# EAGLE design Strvo_Tester_STM_renual_v1 (EAGLE 6.5.0)
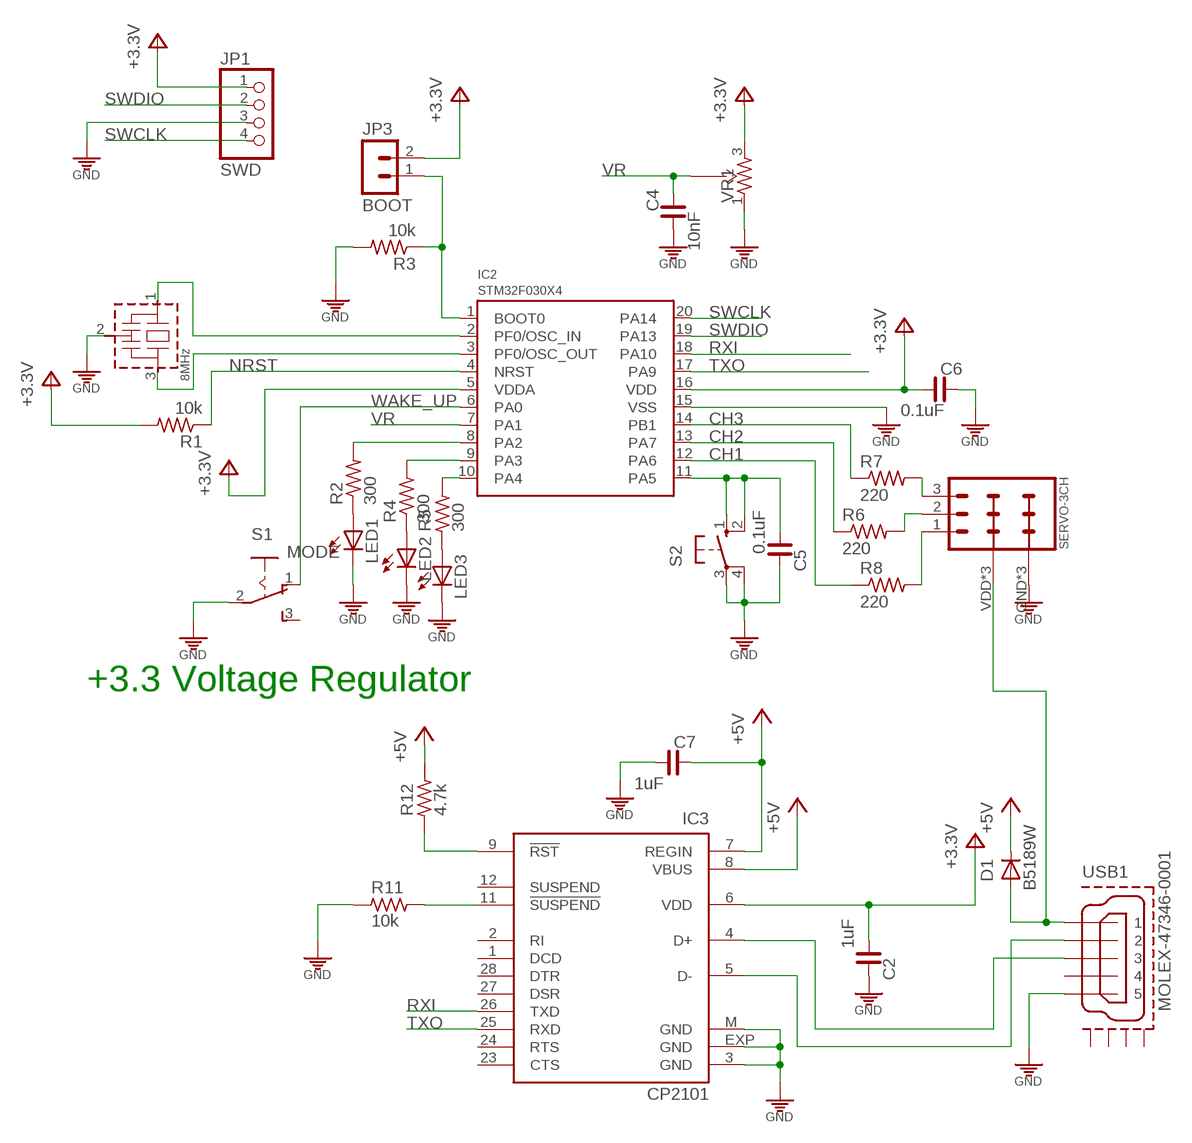
[diagram p0: schematic, sheet 1]

## Parts
C2  1uF  C_0603  [C0603]
C4  10nF  C_0603  [C0603]
C5  0.1uF  C_0603  [C0603]
C6  0.1uF  C_0603  [C0603]
C7  1uF  C_0603  [C0603]
D1  B5189W  B5189WN  [SOD323]
IC2  STM32F030X4  [TSSOP20]
IC3  CP2101  [MLP28]
JP1  SWD  PINHD-1X4M  [1X04M]
JP2  SERVO-3CH  [SERVO-3CH1]
JP3  BOOT  MA021.25  [MA02-MINI]
LED1  LED3MM  [LED3MM]
LED2  LED3MM  [LED3MM]
LED3  LED3MM  [LED3MM]
Q1  8MHz  X-TAL-SMALLCSTCE16M00V53  [CSTLA_X]
R1  10k  R-US_R1608  [R0603]
R2  300  R-US_R1608  [R0603]
R3  10k  R-US_R1608  [R0603]
R4  300  R-US_R1608  [R0603]
R5  300  R_0603  [R0603]
R6  220  R-US_R1608  [R0603]
R7  220  R-US_R1608  [R0603]
R8  220  R-US_R1608  [R0603]
R11  10k  R_0603  [R0603]
R12  4.7k  R_0603  [R0603]
S1  MODE  IMMS  [255SB]
S2  10-XX  [B3F-10XX]
USB1  MOLEX-47346-0001  [MOLEX-47364-0001]
VR1  R-TRIMMER-SMDPTV  [PTV09]

## Nets
3V3: C2.2 C6.2 IC2.5(VDDA) IC2.16(VDD) IC3.6(VDD) JP1.1 JP3.2 R1.2 VR1.3 ; supply symbol labelled +3V3
+5V: C7.1 D1.C IC3.7(REGIN) IC3.8(VBUS) R12.2
CH1: IC2.12(PA6) R8.1
CH2: IC2.13(PA7) R6.1
CH3: IC2.14(PB1) R7.1
GND: C2.1 C4.2 C5.1 C6.1 C7.2 IC2.15(VSS) IC3.3(GND) IC3.EXP(GND) IC3.M(GND) JP1.3 JP2.GND JP2.GND@1(GND) JP2.GND@2(GND) LED1.K(C) LED2.K(C) LED3.K(C) Q1.2(GND) R3.2 R11.1 S1.2(P) S2.3(P) S2.4(P1) USB1.5 VR1.1
N$1: LED1.A R2.1
N$2: IC2.2(PF0/OSC_IN) Q1.1(IN)
N$3: IC2.3(PF0/OSC_OUT) Q1.3(OUT)
N$4: JP2.3 R7.2
N$5: IC2.8(PA2) R2.2
N$6: IC2.1(BOOT0) JP3.1 R3.1
N$7: C5.2 IC2.11(PA5) S2.1(S) S2.2(S1)
N$8: IC3.5(D-) USB1.2
N$9: JP2.2 R6.2
N$10: IC2.10(PA4) R5.2
N$11: LED2.A R4.1
N$12: JP2.1 R8.2
N$13: IC2.9(PA3) R4.2
N$17: LED3.A R5.1
N$20: IC3.4(D+) USB1.3
N$22: D1.A JP2.VDD(+5V) JP2.VDD@1(+5V) JP2.VDD@2(+5V) USB1.1
N$23: IC3.11(!SUSPEND) R11.2
N$24: IC3.9(!RST) R12.1
NRST: IC2.4(NRST) R1.1
RXI: IC2.18(PA10) IC3.26(TXD)
SWCLK: IC2.20(PA14) JP1.4
SWDIO: IC2.19(PA13) JP1.2
TXO: IC2.17(PA9) IC3.25(RXD)
VR: C4.1 IC2.7(PA1) VR1.2
WAKE_UP: IC2.6(PA0) S1.1(O)
Unconnected: IC3.1(DCD) IC3.2(RI) IC3.12(SUSPEND) IC3.23(CTS) IC3.24(RTS) IC3.27(DSR) IC3.28(DTR) S1.3(S) USB1.4 USB1.GND1 USB1.GND2 USB1.GND3 USB1.GND4

## Notes on the sheet
- +3.3 Voltage Regulator

## Library data of the parts
C2 C4-C7 = cona_lib:C_: NON-POLARIZED CAP
D1 = cona_lib:B5189W
IC2 = stm32:STM32F030X4
IC3 = silabs:CP210*: Single-Chip USB to UART Bridge Source: www.silabs.com .. CP2101.pdf / cp2102.pdf; MF: FARNELL; MPN: CP2102-GM; OC_FARNELL: 9282130; OC_NEWARK: 30K5635
JP1 = pinhead:PINHD-1X4: PIN HEADER
JP2 = cona_lib:SERVO-3CH
JP3 = cona_lib:MA02
LED1-LED3 = cona_lib:LED: LED OSRAM: - CHIPLED LG R971, LG N971, LY N971, LG Q971, LY Q971, LO R971, LY R971 LH N974, LH R974 LS Q976, LO Q976, LY Q976 LO Q996 - Hyper CHIPLED LW Q18S LB Q993, LB Q99A, LB R99A - SideLED LS A670, LO A670, LY A670, LG A670, LP A670 LB A673, LV A673, LT A673, LW A673 LH A674 LY A675 LS A676, LA A676, LO A676, LY A676, LW A676 LS A679, LY A679, LG A679 - Hyper Micro SIDELED® LS Y876, LA Y876, LO Y876, LY Y876 LT Y87S - SmartLED LW L88C, LW L88S LB L89C, LB L89S, LG L890 LS L89K, LO L89K, LY L89K LS L896, LA L896, LO L896, LY L896 - TOPLED LS T670, LO T670, LY T670, LG T670, LP T670 LSG T670, LSP T670, LSY T670, LOP T670, LYG T670 LG T671, LOG T671, LSG T671 LB T673, LV T673, LT T673, LW T673 LH T674 LS T676, LA T676, LO T676, LY T676, LB T676, LH T676, LSB T676, LW T676 LB T67C, LV T67C, LT T67C, LS T67K, LO T67K, LY T67K, LW E67C LS E67B, LA E67B, LO E67B, LY E67B, LB E67C, LV E67C, LT E67C LW T67C LS T679, LY T679, LG T679 LS T770, LO T770, LY T770, LG T770, LP T770 LB T773, LV T773, LT T773, LW T773 LH T774 LS E675, LA E675, LY E675, LS T675 LS T776, LA T776, LO T776, LY T776, LB T776 LHGB T686 LT T68C, LB T68C - Hyper Mini TOPLED® LB M676 - Mini TOPLED Santana® LG M470 LS M47K, LO M47K, LY M47K Source: http://www.osram.convergy.de LUXEON: - LUMILED® LXK2-PW12-R00, LXK2-PW12-S00, LXK2-PW14-U00, LXK2-PW14-V00 LXK2-PM12-R00, LXK2-PM12-S00, LXK2-PM14-U00 LXK2-PE12-Q00, LXK2-PE12-R00, LXK2-PE12-S00, LXK2-PE14-T00, LXK2-PE14-U00 LXK2-PB12-K00, LXK2-PB12-L00, LXK2-PB12-M00, LXK2-PB14-N00, LXK2-PB14-P00, LXK2-PB14-Q00 LXK2-PR12-L00, LXK2-PR12-M00, LXK2-PR14-Q00, LXK2-PR14-R00 LXK2-PD12-Q00, LXK2-PD12-R00, LXK2-PD12-S00 LXK2-PH12-R00, LXK2-PH12-S00 LXK2-PL12-P00, LXK2-PL12-Q00, LXK2-PL12-R00 Source: www.luxeon.com KINGBRIGHT: KA-3528ASYC Source: www.kingbright.com
Q1 = cona_lib:X-TAL-SMALL: Ceramic Resonators MuRata CSTCE08MOOG52A
R1-R4 R6-R8 = cona_lib:R-US_: RESISTOR, American symbol
R5 R11 R12 = cona_lib:R_: RESISTOR
S1 = cona_lib:IMMS: SLIDING SWITCH Distributor Buerklin, 11G810
S2 = switch-omron:10-XX: OMRON SWITCH; MPN: B3F-1000; OC_FARNELL: 176432; OC_NEWARK: 36M3542
USB1 = usb_con-update:MOLEX-47346-0001: MICRO USB B, BOTTOM MOUNT
VR1 = cona_lib:R-TRIMMER-SMD: SMD R-TRIMMER

## Net classes
0 default: clearance 0.152 mm
2 GND: width 0.2 mm, clearance 0.152 mm

## Board
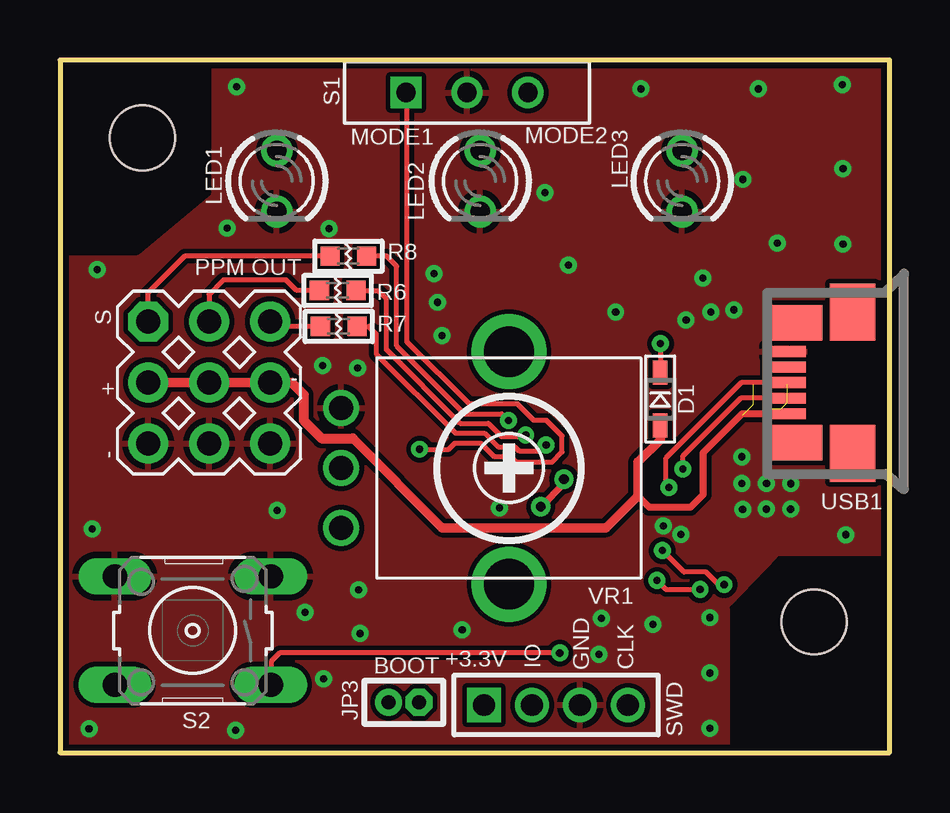
[diagram p1: board, top side]
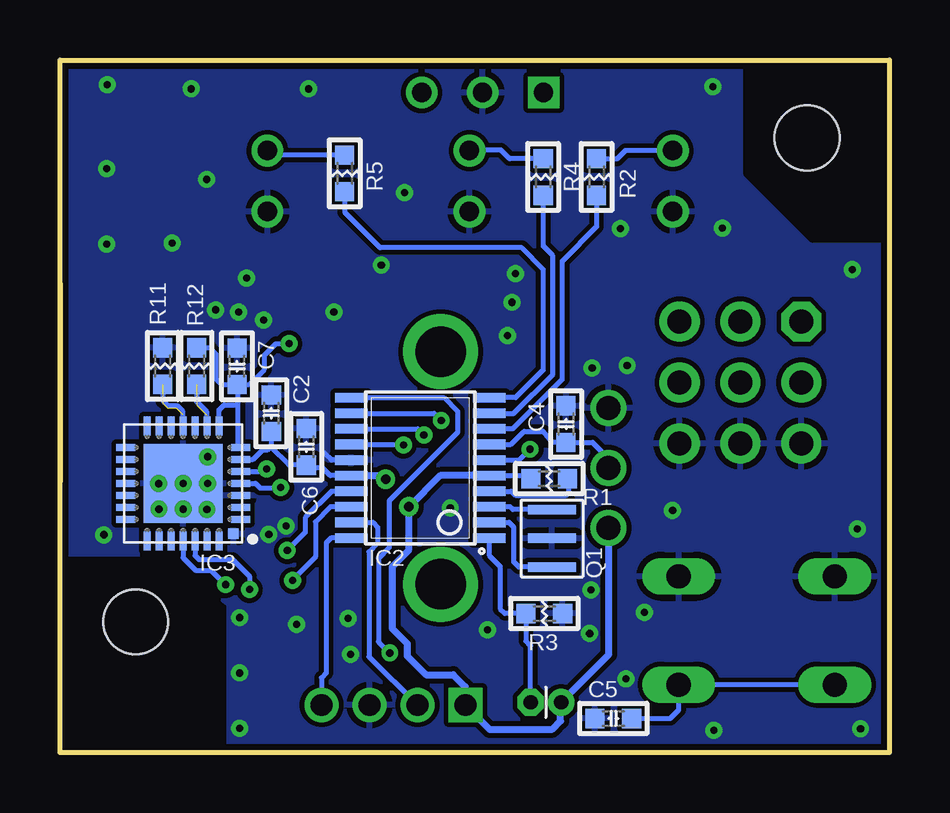
[diagram p2: board, bottom side, seen from below]

Size 34.58 x 28.88 mm. Coordinates in mm from the lower left corner, seen from the top.
Outline: 34.58,0 34.58,28.88 0,28.88 0,0 34.58,0
Copper layers (1+16): Top 0.035mm / dielectric 1.5mm / Bottom 0.035mm
Design rules "default": minimum track width 0.2mm, minimum drill 0.3mm, track to track 0.2mm, track to pad 0.2mm, pad to pad 0.2mm, via to via 0.2mm, smd to smd 0.2mm, copper to edge 10mil, drill to drill 0.2mm, minimum pad ring 10mil, minimum via ring 8mil, stop-mask expansion 4mil, vias tented up to drill 0mil, thermal gap 10mil
Holes 2.7 mm at 31.43,5.45 3.43,25.63

### Footprints (pad centres in the part's own frame; a part is rotated, then mirrored left to right if it is on the bottom)
C0603 = smd 0.8 x 0.8: 1 -0.762,0; 2 0.762,0
SOD323 = smd 1 x 0.6: A 1.1,0; C -1.1,0
TSSOP20 = smd 0.4 x 1.35: 1 -2.925,-2.875; 2 -2.275,-2.875; 3 -1.625,-2.875; 4 -0.975,-2.875; 5 -0.325,-2.875; 6 0.325,-2.875; 7 0.975,-2.875; 8 1.625,-2.875; 9 2.275,-2.875; 10 2.925,-2.875; 11 2.925,2.875; 12 2.275,2.875; 13 1.625,2.875; 14 0.975,2.875; 15 0.325,2.875; 16 -0.325,2.875; 17 -0.975,2.875; 18 -1.625,2.875; 19 -2.275,2.875; 20 -2.925,2.875
MLP28 = smd 0.8 x 0.3: 1 -2.4,1.5; 2 -2.4,1; 3 -2.4,0.5; 4 -2.4,0; 5 -2.4,-0.5; 6 -2.4,-1; 7 -2.4,-1.5; 15 2.4,-1.5; 16 2.4,-1; 17 2.4,-0.5; 18 2.4,0; 19 2.4,0.5; 20 2.4,1; 21 2.4,1.5 | smd 0.3 x 0.8: 8 -1.5,-2.4; 9 -1,-2.4; 10 -0.5,-2.4; 11 0,-2.4; 12 0.5,-2.4; 13 1,-2.4; 14 1.5,-2.4; 22 1.5,2.4; 23 1,2.4; 24 0.5,2.4; 25 0,2.4; 26 -0.5,2.4; 27 -1,2.4; 28 -1.5,2.4 | smd 3.3 x 3.3: EXP 0,0 | smd 0.435 x 0.435: M -2.103,2.103
1X04M = drill 0.914 square: 1 -3,0 | drill 0.914: 2 -1,0; 3 1,0; 4 3,0
SERVO-3CH1 = drill 1 pad 1.676 octagon: 1 -2.54,2.54 | drill 1 pad 1.676: 2 0,2.54; 3 2.54,2.54; GND -2.54,-2.54; GND@1 0,-2.54; GND@2 2.54,-2.54; VDD -2.54,0; VDD@1 0,0; VDD@2 2.54,0
MA02-MINI = drill 0.6 pad 1 octagon: 1 -0.635,0 | drill 0.6 pad 1: 2 0.635,0
LED3MM = drill 0.813: A -1.27,0; K 1.27,0
CSTLA_X = smd 0.4 x 2: 1 -1.19,-0.02; 2 0.01,-0.02; 3 1.21,-0.02
R0603 = smd 0.8 x 0.8: 1 -0.762,0; 2 0.762,0
255SB = drill 0.8 square: 1 -2.54,0 | drill 0.8: 2 0,0; 3 2.54,0
B3F-10XX = drill 1.016 long: 1 -3.251,2.261; 2 3.251,2.261; 3 -3.251,-2.261; 4 3.251,-2.261
MOLEX-47364-0001 = smd 1.7 x 0.45: 1 2.8,1.3; 2 2.8,0.65; 3 2.8,0; 4 2.8,-0.65; 5 2.8,-1.3 | smd 1.9 x 2.375: GND1 0,2.95; GND4 0,-2.95 | smd 2.1 x 1.475: GND2 2.3,2.5; GND3 2.3,-2.5
PTV09 = drill 1: 1 -2.5,-7; 2 0,-7; 3 2.5,-7 | drill 2.1 pad 2.54: P$1 -4.85,0; P$2 4.85,0

### Placement (x,y rotation side)
C2  25.77,14.15 270 bottom
C4  13.49,13.7 90 bottom
C5  11.51,1.43 0 bottom
C6  24.31,12.75 270 bottom
C7  27.2,16.11 90 bottom
D1  25.02,14.74 270 top
IC2  19.56,11.88 90 bottom
IC3  29.45,11.22 180 bottom
JP1  20.68,1.98 0 top
JP2  6.21,15.43 0 top
JP3  14.33,2.1 180 top
LED1  9.03,23.83 270 top
LED2  17.51,23.83 270 top
LED3  25.93,23.83 270 top
Q1  14.09,8.92 90 bottom
R1  14.19,11.42 180 bottom
R2  12.21,24 270 bottom
R3  14.38,5.8 0 bottom
R4  14.44,24 270 bottom
R5  22.71,24.15 270 bottom
R6  11.57,19.27 180 top
R7  11.61,17.77 180 top
R8  12.02,20.7 180 top
R11  30.3,16.12 270 bottom
R12  28.89,16.12 90 bottom
S1  16.96,27.52 0 top
S2  5.53,5.09 180 top
USB1  33.03,15.43 180 top
VR1  18.71,11.87 270 top

### Tracks (layer width: path | path; a pad name or v marks a point on that pad's centre or on a via)
3V3  (via drill 0.4)
  Top 0.3: v21,11.4 21,11.22 v20.04,10.25
  Bottom 0.2: IC2.5 14.97,11.55 R1.2 | IC2.16 23.31,11.55 23.64,11.88 24.1,11.88 C6.2 25.04,11.99 25.8,12.75 | 25.79,13.18 C2.2 25.77,12.79 25.8,12.75 | IC3.6 26.54,12.22 26.13,12.63 25.93,12.63 25.8,12.75
  Bottom 0.3: VR1.3 11.71,4.08 JP3.2 13.71,2.08 13.71,1.32 14.08,0.95 16.66,0.95 16.66,0.98 JP1.1 17.68,2 17.68,2.75 18.19,3.25 19.33,3.25 20.11,4.03 20.11,4.55 20.73,5.18 20.73,7.75 20.03,8.46 v20.03,10.24 v20.04,10.25 18.73,11.55 IC2.5 | IC2.16 21.15,11.55 v21,11.4
+5V  (via drill 0.3)
  Top 0.2: v25.03,17.05 25.03,15.86 D1.C
  Bottom 0.2: 27.21,15.34 C7.1 | R12.2 28.34,16.88 28.09,16.62 28.09,15.6 27.84,15.35 C7.1 | C7.1 | IC3.7 27.16,12.74 27.16,14.5 | C7.1 26.68,15.35 26.05,15.98 26.05,16.58 25.58,17.05 v25.03,17.05 | 27.16,14.5 27.16,15.31 C7.1 | IC3.8 27.95,14.29 27.73,14.5 27.16,14.5
CH1  (via drill 0.3)
  Top 0.2: R8.1 13.61,20.7 14.03,20.28 14.03,16.95 16.86,14.13 18.41,14.13 v18.68,13.85
  Bottom 0.2: IC2.12 18.98,14.15 v18.68,13.85
CH2  (via drill 0.3)
  Top 0.2: R6.1 12.35,19.25 13.26,19.25 13.61,18.91 13.61,16.8 16.68,13.73 17.86,13.73 18.41,13.18 19.34,13.18 v19.41,13.25
  Bottom 0.2: IC2.13 19.66,13.5 v19.41,13.25
CH3  (via drill 0.3)
  Top 0.2: 20.26,12.85 v20.26,12.82 20.02,12.58 19.13,12.58 18.96,12.75 18.25,12.75 17.69,13.32 16.49,13.32 13.18,16.63 13.18,17.45 12.86,17.77 R7.1
  Bottom 0.2: IC2.14 20.26,12.85 v20.26,12.82
GND  (via drill 0.3)
  Bottom 0.2: IC2.15 23.26,12.2 23.56,12.5
  other vias: 10.99,3.07 15.59,19.98 11.21,21.85 18.31,10.2 24.71,5.35 10.21,5.85 6.96,21.88 7.36,27.76 1.34,9.33 20.21,23.35 28.46,23.9 29.91,21.25 32.61,27.85 32.63,24.35 32.63,21.2 24.21,27.68 1.21,1 29.11,27.68 21.18,20.32 23.16,18.36 15.74,18.77 22.46,4.1 16.76,5.12 1.54,20.14 7.31,0.93 27.09,1.01 32.75,9.08 27.09,5.63 28.46,10.14 30.46,10.15 29.45,11.22 28.42,12.33 30.46,11.21 28.43,11.22 29.45,10.15 22.57,5.59 12.5,4.96 12.44,6.79 15.92,17.38 27.13,18.38 25.88,9.1 26.8,19.79 26.09,18.04 28.09,18.46 25.16,9.45 27.09,3.32 10.94,16.14 12.39,16.04 9.04,10.1
  pour Top (rank 3): 0,0 0,28.88 34.58,28.88 34.58,0
  pour Bottom (rank 2): 0,0 0,28.88 34.58,28.88 34.58,0
N$1
  Bottom 0.2: LED1.A 11.01,25.1 11.36,24.75 R2.1
N$2
  Bottom 0.2: IC2.2 15.86,9.6 15.66,9.4 15.66,7.95 15.45,7.73 Q1.1
N$3
  Bottom 0.2: Q1.3 15.7,10.13 15.81,10.25 IC2.3
N$4
  Top 0.2: R7.2 8.95,17.77 JP2.3
N$5
  Bottom 0.2: IC2.8 15.71,13.5 13.63,15.57 13.63,20.5 12.21,21.93 R2.2
N$6
  Bottom 0.2: IC2.1 16.68,8.23 16.23,7.77 16.23,6 16.04,5.8 R3.1 15.15,4.66 15.16,4.66 14.96,4.46 JP3.1
N$7  (via drill 0.3)
  Top 0.2: v20.83,4.16 9.15,4.16 8.8,3.8 8.8,2.85 S2.1
  Bottom 0.2: S2.2 S2.1 8.78,1.78 9.13,1.43 C5.2 | IC2.11 18.57,14.8 18,14.23 18,13.36 20.86,10.5 20.86,8.55 21.3,8.11 21.3,4.63 v20.83,4.16
N$8  (via drill 0.3)
  Top 0.2: USB1.2 28.38,14.78 25.96,12.36 v25.96,11.82
  Bottom 0.2: 27.12,11.7 IC3.5 26.06,11.72 v25.96,11.82
N$9
  Top 0.2: R6.2 9.86,19.27 9.43,19.7 6.8,19.7 6.21,19.11 JP2.2
N$10
  Bottom 0.2: IC2.10 15.59,14.8 14.44,15.95 14.44,20.16 15.33,21.05 21.23,21.05 22.71,22.54 R5.2
N$11
  Bottom 0.2: R4.1 15.84,24.76 16.2,25.13 17.48,25.13 LED2.A
N$12
  Top 0.2: R8.2 5.2,20.7 3.66,19.16 3.66,17.98 JP2.1
N$13
  Bottom 0.2: IC2.9 16.66,14.12 15.69,14.12 14.04,15.78 14.04,20.71 14.43,21.11 R4.2
N$16
  cutout Bottom: 0,21.35 3.21,21.35 5.98,24.12 5.98,28.88 0,28.88
  cutout Top: 0,20.85 3.21,20.85 6.21,23.35 6.21,28.88 0,28.88
N$17
  Bottom 0.2: R5.1 25.67,24.91 LED3.A
N$19
  cutout Bottom: 34.58,8.08 29.98,8.08 27.75,6.08 27.75,0 34.58,0
  cutout Top: 34.58,8.08 29.98,8.08 28.02,6.04 28.02,0 34.58,0
N$20  (via drill 0.3)
  Top 0.2: USB1.3 28.41,15.43 25.25,12.28 25.25,11.18 v25.38,11.05
  Bottom 0.2: IC3.4 26.43,11.22 26.23,11.03 25.41,11.03 v25.38,11.05
N$22
  Top 0.3: USB1.1 28.43,14.13 26.8,12.5 26.8,10.75 26.28,10.23 24.56,10.23 24.09,10.71
  Top 0.4: JP2.VDD@2 JP2.VDD@1 JP2.VDD | D1.A 25.02,13.04 24.09,12.11 24.09,10.71 22.76,9.38 15.93,9.38 12.21,13.1
  Top 0.406: JP2.VDD@2 9.65,15.43 10.15,14.93 10.15,13.86 10.91,13.11 12.21,13.11 12.21,13.1
N$23  (4 unrouted)
  Bottom 0.2: IC3.11 29.45,14.22 29.68,14.46 30.08,14.46 30.3,14.67 R11.2
N$24  (2 unrouted)
  Bottom 0.2: IC3.9 28.45,14.2 28.89,14.63 R12.1
NRST
  Bottom 0.2: IC2.4 15.76,10.9 15.59,10.72 13.49,10.72 13.36,10.85 13.36,11.39 R1.1
RXI  (via drill 0.3)
  Top 0.2: v24.88,7.18 25.25,6.8 v26.68,6.8
  Bottom 0.2: IC2.18 23.31,10.25 23.93,9.63 23.93,8.16 24.88,7.2 v24.88,7.18 | v26.68,6.8 26.68,7.36 27.38,8.05 28.78,8.05 28.95,8.22 IC3.26
SWCLK
  Bottom 0.2: IC2.20 23.29,8.95 23.48,8.75 23.48,3.32 23.68,3.13 JP1.4
SWDIO
  Bottom 0.2: IC2.19 21.54,9.6 21.34,9.4 21.34,8.75 21.71,8.38 21.71,4 21.68,4 JP1.2
TXO  (via drill 0.3)
  Top 0.2: v27.68,7 27.46,7 26.93,7.53 26,7.53 v25.11,8.43
  Bottom 0.2: IC2.17 23.26,10.9 24.36,9.8 24.36,9.18 v25.11,8.43 24.93,8.43 | IC3.25 29.45,8.12 28.93,7.61 28.28,7.61 v27.68,7
VR
  Bottom 0.2: IC2.7 15.79,12.85 15.24,13.4 14.44,13.4 14.09,12.95 13.22,12.95 C4.1 12.37,12.94 11.81,12.38 11.81,11.95 VR1.2
WAKE_UP  (via drill 0.3)
  Top 0.2: S1.1 14.46,27.49 14.46,17.13 17.04,14.55 19.05,14.55 19.75,13.86 20.28,13.86 20.93,13.21 20.93,12.53 20.53,12.13 19,12.13 18.78,12.36 18.08,12.36 17.53,12.9 16.45,12.9 16.2,12.65 v14.99,12.65
  Bottom 0.2: IC2.6 15.44,12.2 v14.99,12.65

### Text on the board
_tsilk: MODE1 | MODE2 | PPM OUT | S | - | + | - | BOOT | +3.3V | IO | GND | CLK | SWD